# EAGLE design OVER_HEATING_DETECTION (EAGLE 9.6.2)
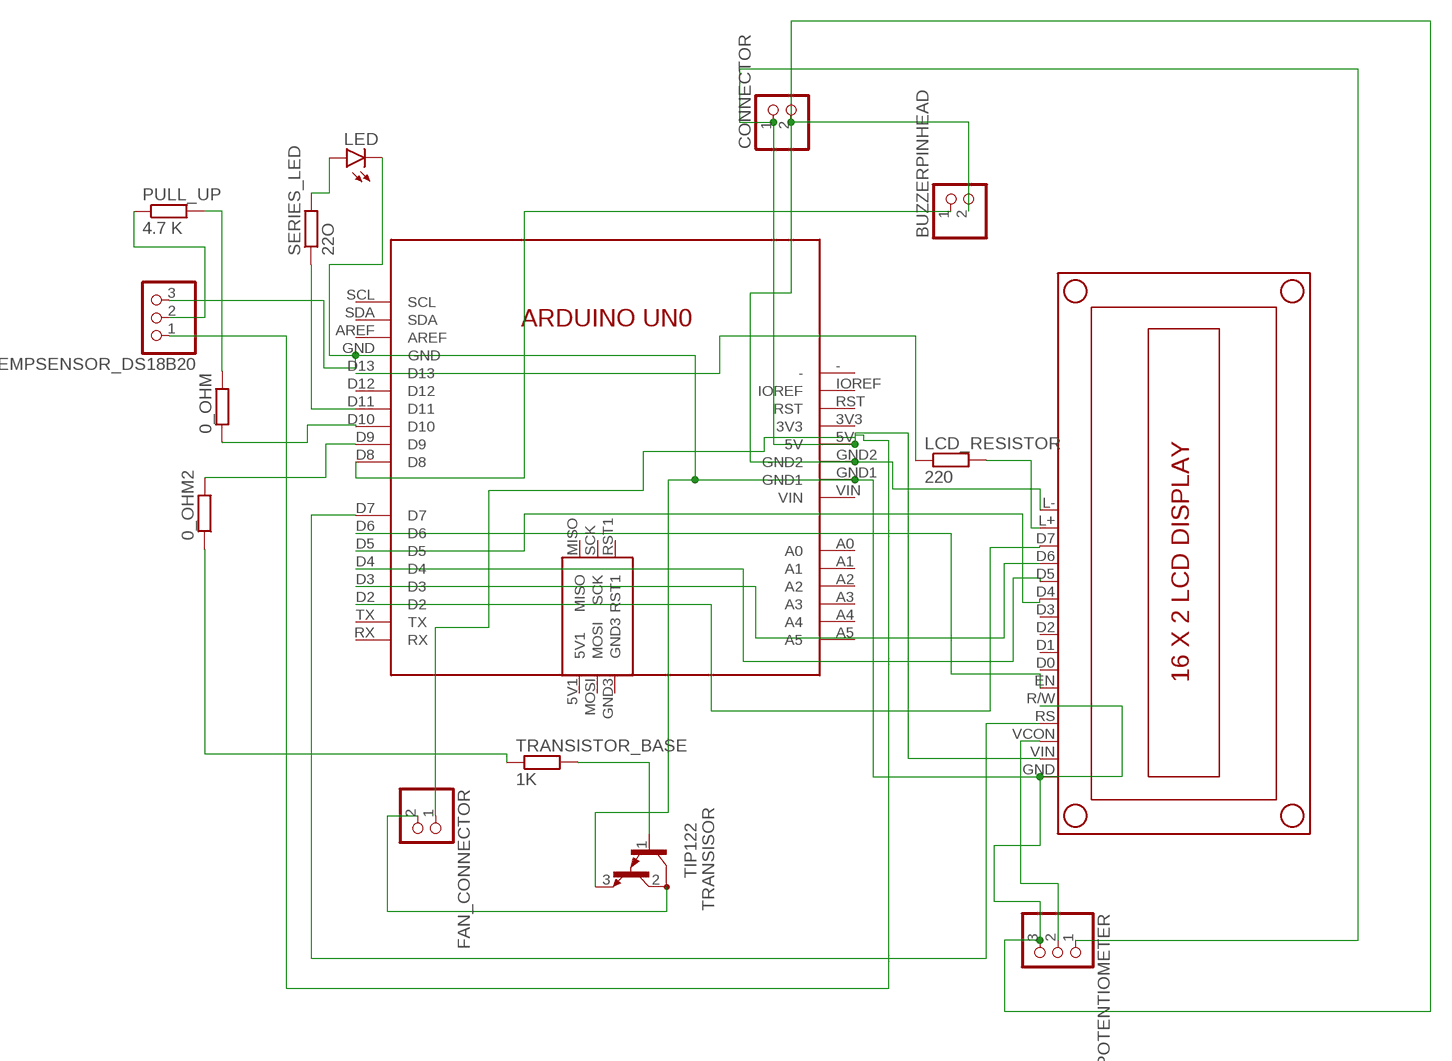
[diagram p0: schematic, sheet 1]

## Parts
0_OHM  R-EU_0204/7  [0204/7]
0_OHM2  R-EU_0204/7  [0204/7]
BUZZERPINHEAD  PINHD-1X2  [1X02]
CONNECTOR  PINHD-1X2  [1X02]
FAN_CONNECTOR  PINHD-1X2  [1X02]
LCD_RESISTOR  220  R-EU_0204/7  [0204/7]
LED  LED5MM  [LED5MM]
POTENTIOMETER  PINHD-1X3  [1X03]
PULL_UP  4.7 K  R-EU_0204/7  [0204/7]
SERIES_LED  22O  R-EU_0204/7  [0204/7]
TEMPSENSOR_DS18B20  PINHD-1X3  [1X03]
TRANSISOR  TIP122  [TO220]
TRANSISTOR_BASE  1K  R-EU_0204/7  [0204/7]
U$1  ARDUINO_UNO  [ARDUINO_UNO]
U$2  16X2_LCD_DISPLAY  [16X2_LCD_DISPLAY]

## Nets
N$1: U$1.D2 U$2.D7
N$2: U$1.D3 U$2.D6
N$3: U$1.D4 U$2.D5
N$4: U$1.D5 U$2.D4
N$5: U$1.D6 U$2.EN
N$6: U$1.D7 U$2.RS
N$7: BUZZERPINHEAD.1 U$1.D8
N$8: 0_OHM2.1 TRANSISTOR_BASE.1
N$9: TRANSISOR.1(B) TRANSISTOR_BASE.2
N$10: 0_OHM.1 U$1.D10
N$11: PULL_UP.1 TEMPSENSOR_DS18B20.2
N$12: LED.A SERIES_LED.2
N$13: SERIES_LED.1 U$1.D11
N$14: BUZZERPINHEAD.2 CONNECTOR.2 LED.K(C) POTENTIOMETER.3 TEMPSENSOR_DS18B20.3 TRANSISOR.3(E) U$1.GND U$1.GND1 U$1.GND2 U$2.GND U$2.L- U$2.R/W
N$15: LCD_RESISTOR.1 U$1.D13
N$16: LCD_RESISTOR.2 U$2.L+
N$17: 0_OHM.2 PULL_UP.2
N$18: CONNECTOR.1 FAN_CONNECTOR.1 POTENTIOMETER.1 TEMPSENSOR_DS18B20.1 U$1.5V U$2.VIN
N$19: POTENTIOMETER.2 U$2.VCON
N$20: 0_OHM2.2 U$1.D9
N$26: FAN_CONNECTOR.2 TRANSISOR.2(C)
Unconnected: U$1.3V3 U$1.5V1 U$1.- U$1.A0 U$1.A1 U$1.A2 U$1.A3 U$1.A4 U$1.A5 U$1.AREF U$1.D12 U$1.GND3 U$1.IOREF U$1.MISO U$1.MOSI U$1.RST U$1.RST1 U$1.RX U$1.SCK U$1.SCL U$1.SDA U$1.TX U$1.VIN U$2.D0 U$2.D1 U$2.D2 U$2.D3

## Library data of the parts
0_OHM 0_OHM2 LCD_RESISTOR PULL_UP SERIES_LED TRANSISTOR_BASE = rcl:R-EU_: RESISTOR, European symbol; SPICEPREFIX: R
BUZZERPINHEAD CONNECTOR FAN_CONNECTOR = pinhead:PINHD-1X2: PIN HEADER
LED = led:LED: LED OSRAM: - CHIPLED LG R971, LG N971, LY N971, LG Q971, LY Q971, LO R971, LY R971 LH N974, LH R974 LS Q976, LO Q976, LY Q976 LO Q996 - Hyper CHIPLED LW Q18S LB Q993, LB Q99A, LB R99A - SideLED LS A670, LO A670, LY A670, LG A670, LP A670 LB A673, LV A673, LT A673, LW A673 LH A674 LY A675 LS A676, LA A676, LO A676, LY A676, LW A676 LS A679, LY A679, LG A679 - Hyper Micro SIDELED® LS Y876, LA Y876, LO Y876, LY Y876 LT Y87S - SmartLED LW L88C, LW L88S LB L89C, LB L89S, LG L890 LS L89K, LO L89K, LY L89K LS L896, LA L896, LO L896, LY L896 - TOPLED LS T670, LO T670, LY T670, LG T670, LP T670 LSG T670, LSP T670, LSY T670, LOP T670, LYG T670 LG T671, LOG T671, LSG T671 LB T673, LV T673, LT T673, LW T673 LH T674 LS T676, LA T676, LO T676, LY T676, LB T676, LH T676, LSB T676, LW T676 LB T67C, LV T67C, LT T67C, LS T67K, LO T67K, LY T67K, LW E67C LS E67B, LA E67B, LO E67B, LY E67B, LB E67C, LV E67C, LT E67C LW T67C LS T679, LY T679, LG T679 LS T770, LO T770, LY T770, LG T770, LP T770 LB T773, LV T773, LT T773, LW T773 LH T774 LS E675, LA E675, LY E675, LS T675 LS T776, LA T776, LO T776, LY T776, LB T776 LHGB T686 LT T68C, LB T68C - Hyper Mini TOPLED® LB M676 - Mini TOPLED Santana® LG M470 LS M47K, LO M47K, LY M47K Source: http://www.osram.convergy.de LUXEON: - LUMILED® LXK2-PW12-R00, LXK2-PW12-S00, LXK2-PW14-U00, LXK2-PW14-V00 LXK2-PM12-R00, LXK2-PM12-S00, LXK2-PM14-U00 LXK2-PE12-Q00, LXK2-PE12-R00, LXK2-PE12-S00, LXK2-PE14-T00, LXK2-PE14-U00 LXK2-PB12-K00, LXK2-PB12-L00, LXK2-PB12-M00, LXK2-PB14-N00, LXK2-PB14-P00, LXK2-PB14-Q00 LXK2-PR12-L00, LXK2-PR12-M00, LXK2-PR14-Q00, LXK2-PR14-R00 LXK2-PD12-Q00, LXK2-PD12-R00, LXK2-PD12-S00 LXK2-PH12-R00, LXK2-PH12-S00 LXK2-PL12-P00, LXK2-PL12-Q00, LXK2-PL12-R00 Source: www.luxeon.com KINGBRIGHT: KA-3528ASYC Source: www.kingbright.com
POTENTIOMETER TEMPSENSOR_DS18B20 = pinhead:PINHD-1X3: PIN HEADER
TRANSISOR = transistor:TIP122: NPN BIPOLAR DARLINGTON TRANSISTOR
U$1 = ARDUINO_UNO:ARDUINO_UNO: Arduino UNO Created by Aadesh Borate Features : Microcontroller ATmega328P Operating Voltage (logic level) = 5 V Input Voltage (Recommended) = 7-12 V Digital I/O Pins : 14 (out of which 6 provide PWM Output) Analog Input Pins = 6 DC Current per I/O Pin = 20 mA Flash Memory 32 KB (ATmega328) of which 0.5 KB KB used by bootloader SRAM: 2 KB (ATmega328) EEPROM: 1 KB (ATmega328) Clock Speed: 16 MHz Dimensions = 68.6 mm × 53.4 mm Buy this module at Robu.in <https://robu.in/product/arduino-uno-r3/> <
U$2 = 16X2_LCD_DISPLAY:16X2_LCD_DISPLAY: 16 x 2 LCD Display Created by Aadesh Borate Features : Operating voltage : 5 V Input Voltage : 5V Current consumption is 1mA without backlight Can work on both 8-bit and 4-bit mode Alphanumeric LCD display module, meaning can display alphabets and numbers Consists of two rows and each row can print 16 characters. Buy this module at Robu.in <https://robu.in/product/basic-16x2-character-lcd-white-on-blue-on-blue-5v/> <

## Board
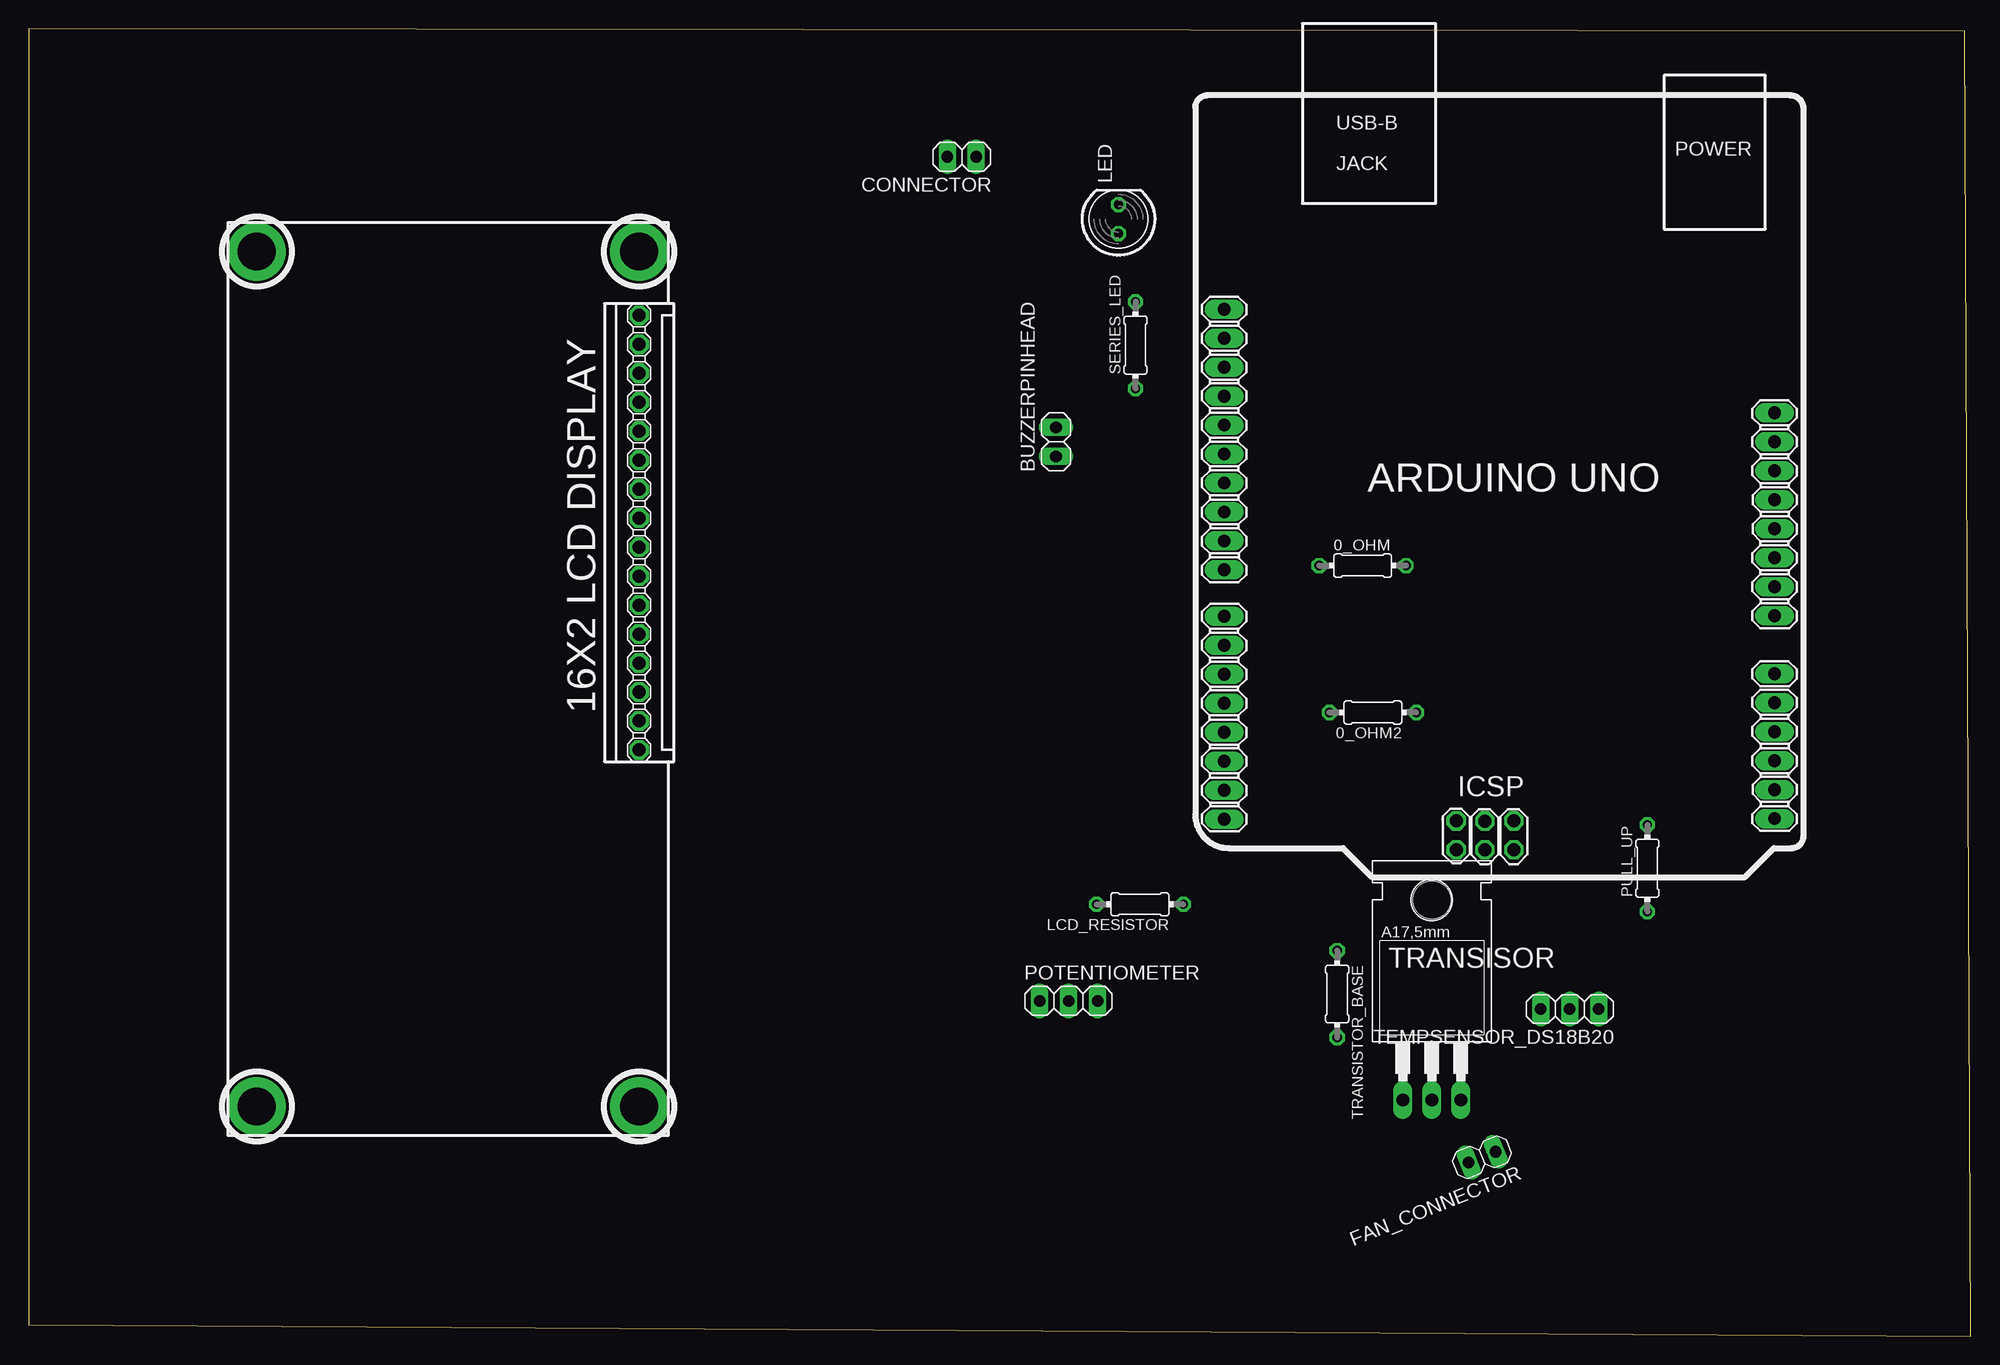
[diagram p1: board, top side]
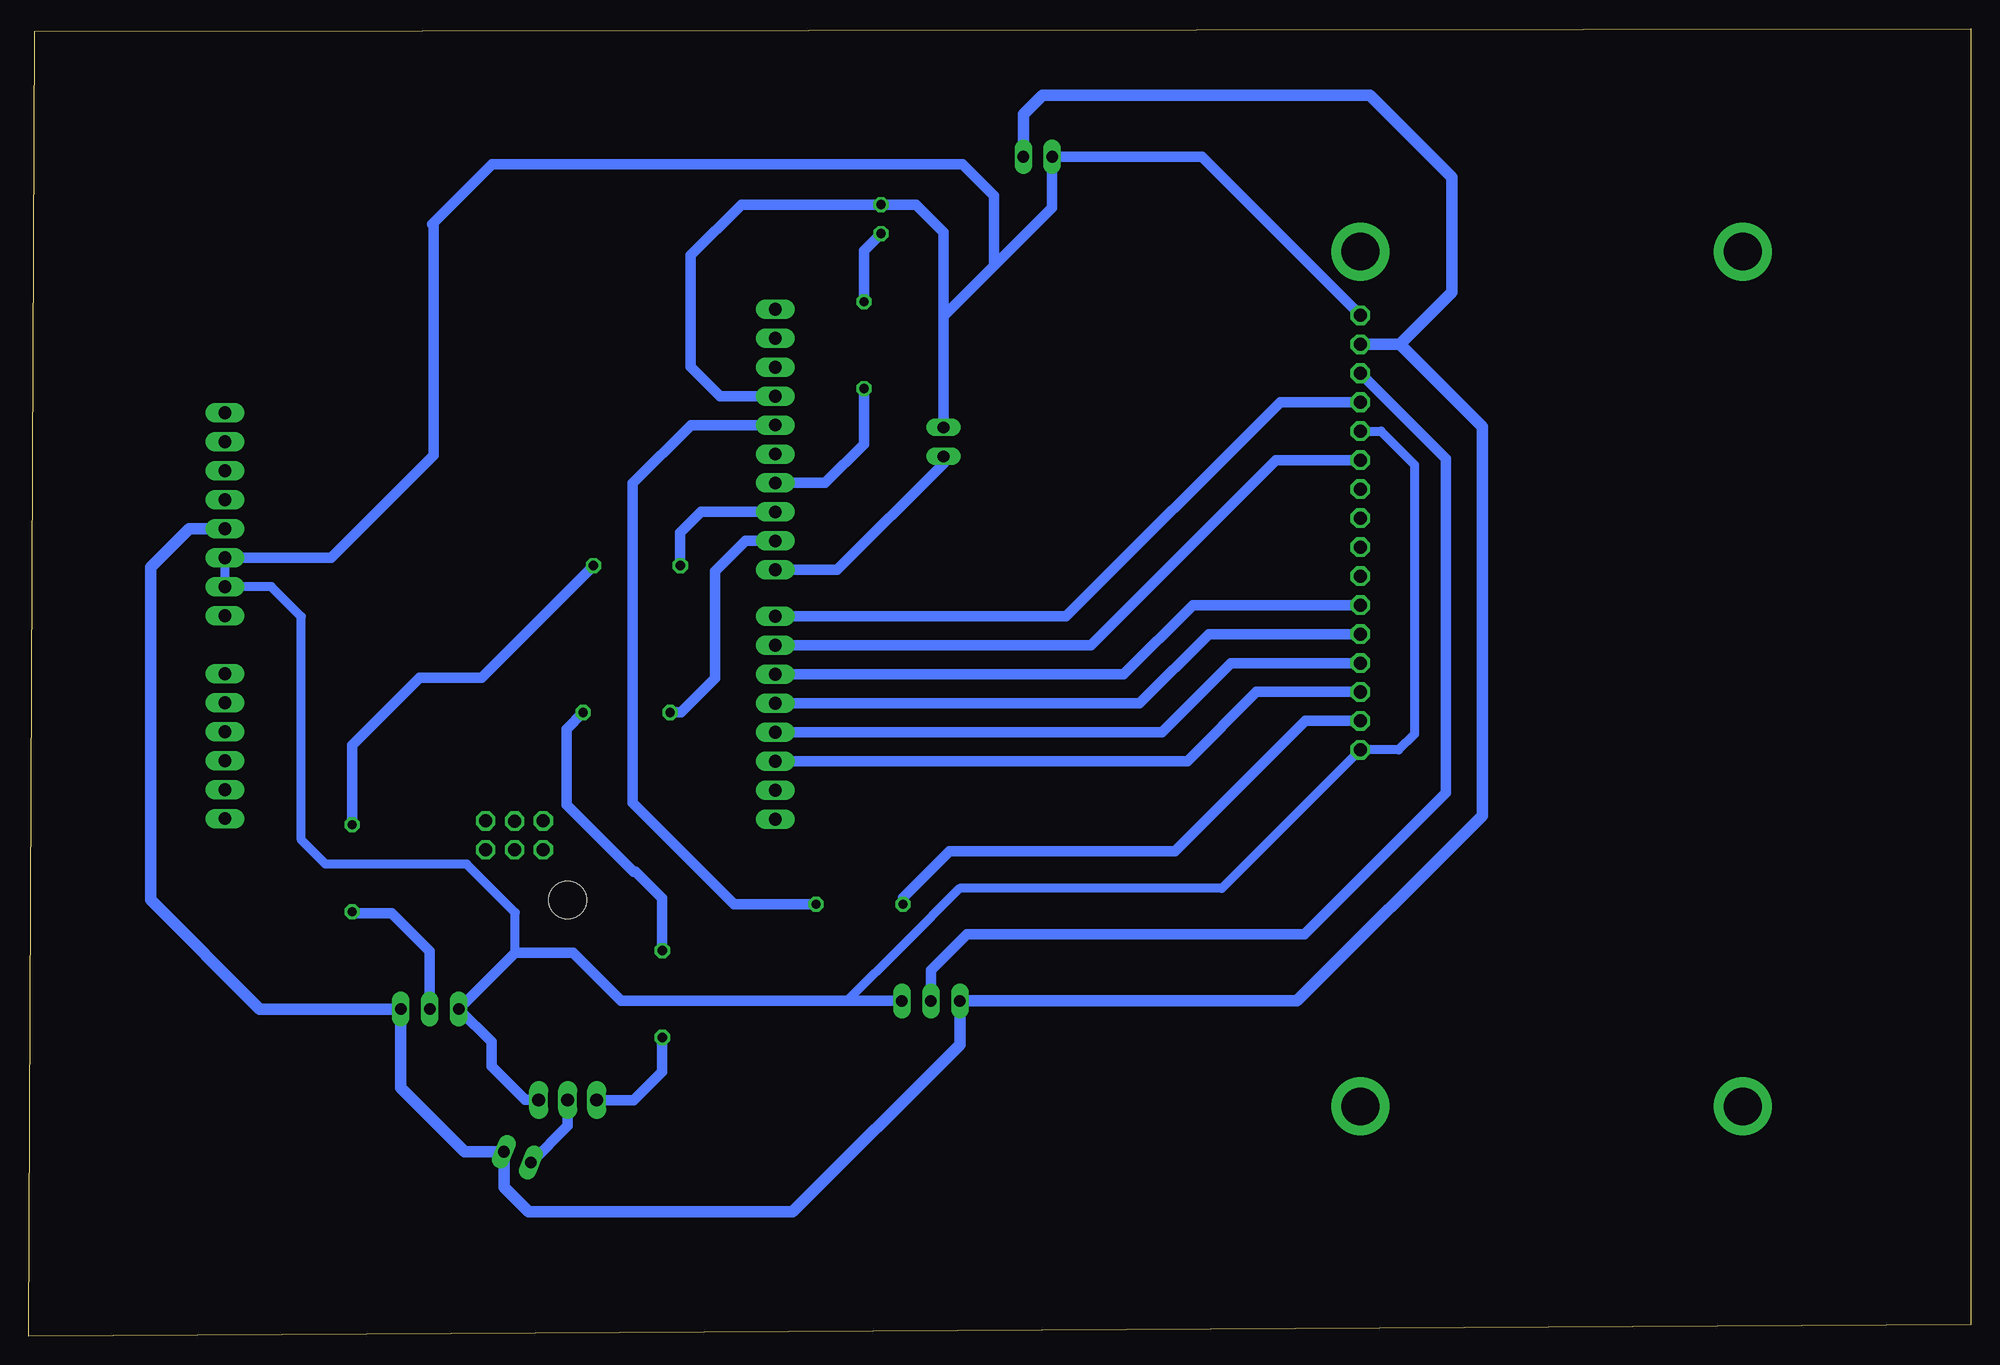
[diagram p2: board, bottom side, seen from below]

Size 170.32 x 114.65 mm. Coordinates in mm from the lower left corner, seen from the top.
Outline: 0,1.03 170.32,0 169.78,114.39 0.04,114.65 0,1.03
Copper layers (1*16): Top 0.035mm / dielectric 1.5mm / Bottom 0.035mm
Design rules "default": minimum track width 6mil, minimum drill 0.35mm, track to track 6mil, track to pad 6mil, pad to pad 6mil, via to via 6mil, smd to smd 6mil, copper to edge 40mil, drill to drill 6mil, minimum pad ring 10mil, minimum via ring 8mil, stop-mask expansion 4mil, vias tented up to drill 0mil, thermal gap 10mil

### Footprints (pad centres in the part's own frame; a part is rotated, then mirrored left to right if it is on the bottom)
0204/7 = drill 0.813 octagon: 1 -3.81,0; 2 3.81,0
1X02 = drill 1.016 long: 1 -1.27,0; 2 1.27,0
LED5MM = drill 0.813 octagon: A -1.27,0; K 1.27,0
1X03 = drill 1.016 long: 1 -2.54,0; 2 0,0; 3 2.54,0
TO220 = drill 1.118 long: 1 -2.54,-6.35; 2 0,-6.35; 3 2.54,-6.35 | hole 3.302: 0,11.176
ARDUINO_UNO = drill 1.13 long: 3V3 24.74,0.864; 5V 24.74,-1.676; - 24.74,8.484; A0 24.74,-14.376; A1 24.74,-16.916; A2 24.74,-19.456; A3 24.74,-21.996; A4 24.74,-24.536; A5 24.74,-27.076; AREF -23.52,12.497; D2 -23.52,-22.047; D3 -23.52,-19.507; D4 -23.52,-16.967; D5 -23.52,-14.427; D6 -23.52,-11.887; D7 -23.52,-9.347; D8 -23.52,-5.283; D9 -23.52,-2.743; D10 -23.52,-0.203; D11 -23.52,2.337; D12 -23.52,4.877; D13 -23.52,7.417; GND -23.52,9.957; GND1 24.74,-6.756; GND2 24.74,-4.216; IOREF 24.74,5.944; RST 24.74,3.404; RX -23.52,-27.127; SCL -23.52,17.577; SDA -23.52,15.037; TX -23.52,-24.587; VIN 24.74,-9.296 | drill 1.13 octagon: 5V1 -3.175,-29.82; GND3 1.88,-29.82; MISO -3.175,-27.28; MOSI -0.66,-29.82; RST1 1.88,-27.28; SCK -0.66,-27.305
16X2_LCD_DISPLAY = drill 1.143 octagon: D0 0.508,7.874; D1 3.048,7.874; D2 5.588,7.874; D3 8.128,7.874; D4 10.668,7.874; D5 13.208,7.874; D6 15.748,7.874; D7 18.288,7.874; EN -2.032,7.874; GND -14.732,7.874; L+ 20.828,7.874; L- 23.368,7.874; R/W -4.572,7.874; RS -7.112,7.874; VCON -9.652,7.874; VIN -12.192,7.874 | drill 3.302 pad 5.08: P$1 -20.32,7.874; P$2 -20.32,-25.654; P$3 54.61,-25.654; P$4 54.61,7.874

### Placement (x,y rotation side)
0_OHM  116.98,67.57 0 top
0_OHM2  117.88,54.69 180 top
BUZZERPINHEAD  90.09,78.42 90 top
CONNECTOR  81.83,103.41 180 top
FAN_CONNECTOR  127.45,15.71 201.8 top
LCD_RESISTOR  97.45,37.88 180 top
LED  95.57,97.94 90 top
POTENTIOMETER  91.2,29.41 0 top
PULL_UP  141.95,41.04 90 top
SERIES_LED  97.07,86.89 90 top
TEMPSENSOR_DS18B20  135.13,28.7 180 top
TRANSISOR  123.05,27.08 0 top
TRANSISTOR_BASE  114.75,30.01 270 top
U$1  128.36,72.47 0 top
U$2  45.67,74.78 270 top

### Tracks (layer width: path | path; a pad name or v marks a point on that pad's centre or on a via)
N$1
  Bottom 0.9: U$2.D7 62.64,56.49 68.7,50.43 U$1.D2
N$2
  Bottom 0.9: U$2.D6 64.89,59.03 70.95,52.97 U$1.D3
N$3
  Bottom 0.9: U$2.D5 66.83,61.57 72.89,55.51 U$1.D4
N$4
  Bottom 0.9: U$2.D4 68.23,64.11 74.29,58.05 U$1.D5
N$5
  Bottom 0.9: U$2.EN 60.95,76.81 77.17,60.59 U$1.D6
N$6
  Bottom 0.9: U$2.RS 60.57,81.89 79.33,63.13 U$1.D7
N$7
  Bottom 0.9: BUZZERPINHEAD.1 90.09,76.52 99.42,67.19 U$1.D8
N$8
  Bottom 0.9: 0_OHM2.1 123.16,53.22 123.16,46.63 117.28,40.75 117.07,40.75 114.75,38.43 TRANSISTOR_BASE.1
N$9
  Bottom 0.9: TRANSISTOR_BASE.2 114.75,23.22 117.27,20.69 120.47,20.69 TRANSISOR.1
N$10
  Bottom 0.9: U$1.D10 111.36,72.27 113.17,70.46 0_OHM.1
N$11
  Bottom 0.9: PULL_UP.1 141.83,37.11 138.5,37.11 135.13,33.74 TEMPSENSOR_DS18B20.2
N$12
  Bottom 0.9: LED.A 97.07,95.18 SERIES_LED.2
N$13
  Bottom 0.9: SERIES_LED.1 97.07,78.2 100.46,74.81 U$1.D11
N$14
  Bottom 0.8: U$1.GND2 U$1.GND1 149.03,65.72 146.41,63.1 146.41,43.53 144.29,41.4 131.89,41.4 127.64,37.14 127.64,33.65 TEMPSENSOR_DS18B20.3 | 98.92,29.41 98.53,29.41 93.55,34.39 88.67,39.27 65.68,39.27 U$2.L- 50.19,51.41 48.8,52.79 48.8,76.41 51.74,79.35 U$2.R/W
  Bottom 0.9: U$1.GND 109.69,82.43 112.25,84.99 112.25,94.76 107.79,99.21 LED.K 92.5,99.21 90.09,96.81 BUZZERPINHEAD.2 90.09,89.43 85.68,93.84 | 93.94,29.6 POTENTIOMETER.3 98.92,29.41 118.38,29.41 122.59,33.62 127.67,33.62 TEMPSENSOR_DS18B20.3 129.72,25.82 129.72,23.68 126.77,20.73 TRANSISOR.3 | 85.68,93.84 80.56,98.96 CONNECTOR.2 67.44,103.41 U$2.GND | U$1.GND2 143.79,68.26 134.82,77.22 134.82,97.34 134.95,97.47 | 134.95,97.47 | 134.95,97.47 129.66,102.76 88.44,102.76 85.68,99.99 85.68,93.84
N$15
  Bottom 0.9: U$1.D13 112.25,79.89 117.36,74.78 117.36,64.39 117.36,46.79 108.45,37.88 LCD_RESISTOR.1
N$16
  Bottom 0.9: U$2.L+ 58.37,53.95 69.8,42.52 89.58,42.52 93.64,38.46 LCD_RESISTOR.2
N$17
  Bottom 0.9: 0_OHM.2 130.61,57.76 136.02,57.76 141.95,51.82 PULL_UP.2
N$18
  Bottom 0.9: 137.7,28.67 TEMPSENSOR_DS18B20.1
  Bottom 1: U$1.5V 156.25,70.8 159.62,67.42 159.62,38.28 150.04,28.7 TEMPSENSOR_DS18B20.1 | U$2.VIN 50.06,86.97 | 50.06,86.97 45.5,91.53 45.5,101.61 52.71,108.81 81.42,108.81 83.1,107.13 CONNECTOR.1 | POTENTIOMETER.1 59.09,29.41 42.84,45.66 42.84,79.74 50.06,86.97
  Bottom 1.016: 53.44,86.87 U$2.VIN | POTENTIOMETER.1 88.66,25.58 103.32,10.91 126.47,10.91 128.63,13.07 FAN_CONNECTOR.1 132.07,16.18 137.67,21.78 TEMPSENSOR_DS18B20.1
N$19
  Bottom 0.9: U$2.VCON 46.06,76.95 46.06,47.65 58.44,35.27 88.05,35.27 91.2,32.11 POTENTIOMETER.2
N$20
  Bottom 0.9: U$1.D9 107.47,69.73 110.11,67.09 110.11,57.68 113.09,54.69 0_OHM2.2
N$26
  Bottom 0.9: TRANSISOR.2 123.05,18.46 FAN_CONNECTOR.2